# EAGLE design RocketInstrumentation (EAGLE 5.11)
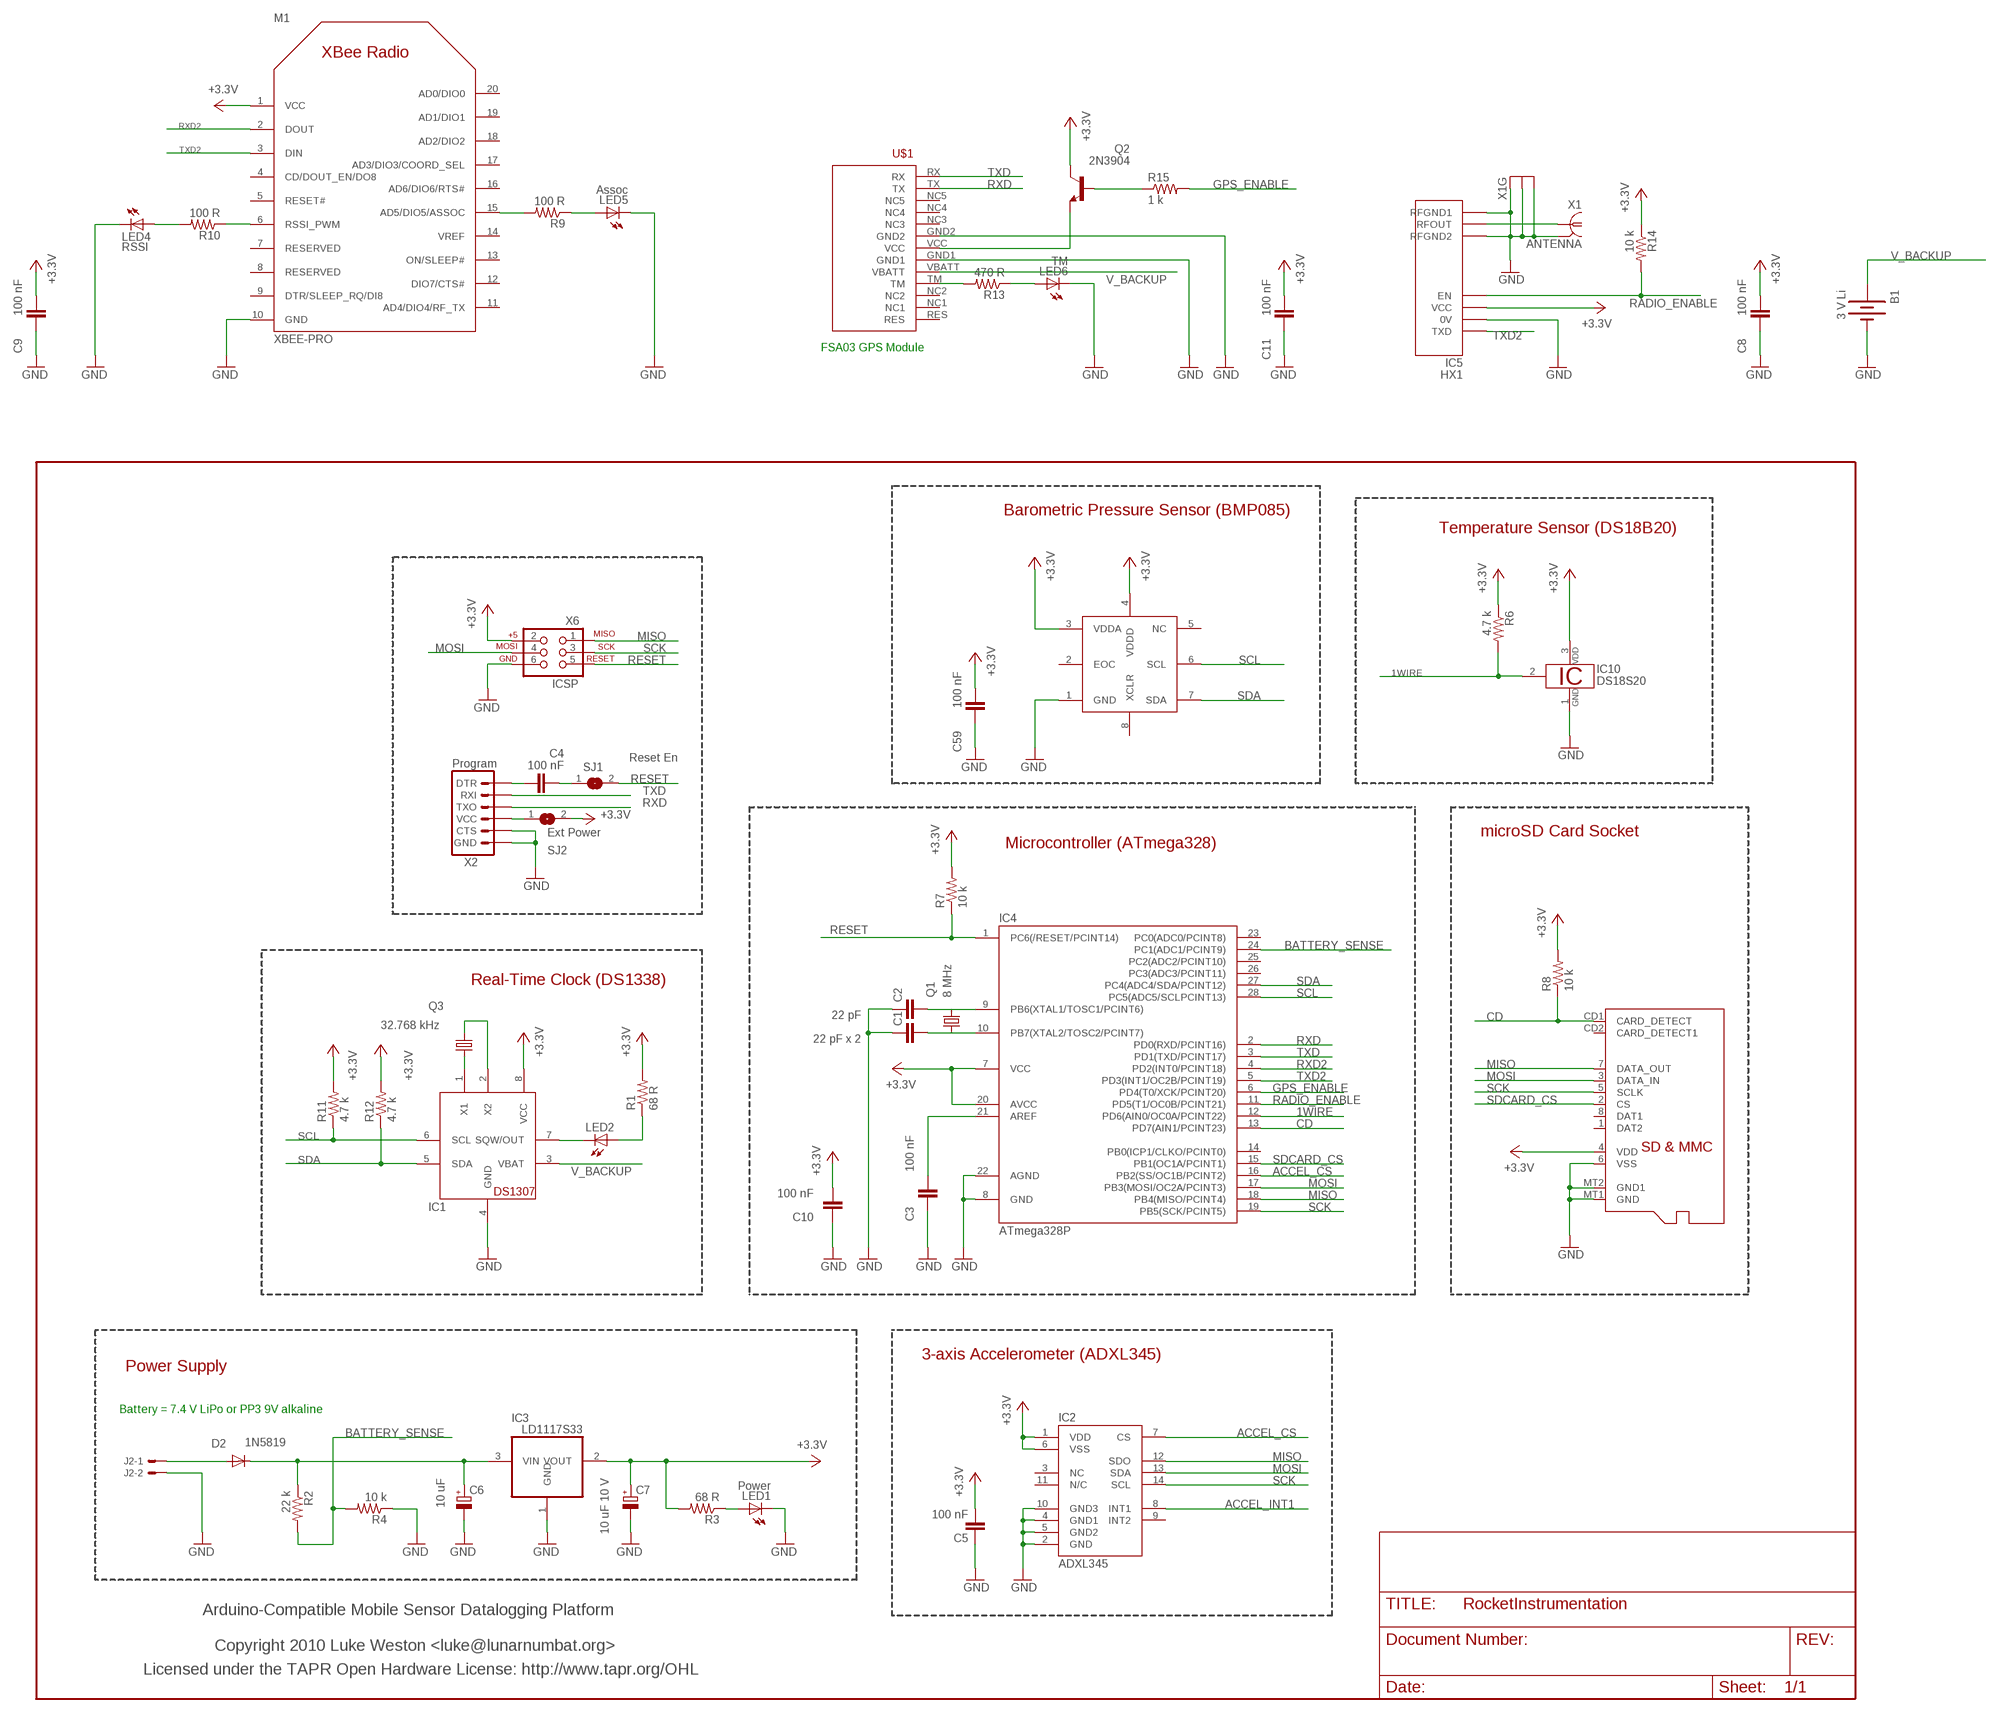
[diagram p0: schematic, sheet 1]

## Parts
B1  3 V Li  BATTERY12PTH  [BATTCON_12MM_PTH]
C1  22 pF x 2  C-EU025-024X044  [C025-024X044]
C2  22 pF  C-EU025-024X044  [C025-024X044]
C3  100 nF  C-EU025-025X050  [C025-025X050]
C4  100 nF  C-EU025-025X050  [C025-025X050]
C5  100 nF  C-EU025-025X050  [C025-025X050]
C6  10 uF  CPOL-EUE2.5-7  [E2,5-7]
C7  10 uF 10 V  CPOL-EUE2.5-7  [E2,5-7]
C8  100 nF  C-EU025-025X050  [C025-025X050]
C9  100 nF  C-EU025-025X050  [C025-025X050]
C10  100 nF  C-EU025-025X050  [C025-025X050]
C11  100 nF  C-EU025-025X050  [C025-025X050]
C59  100 nF  C-EU025-025X050  [C025-025X050]
D2  1N5819  DIODE-DO35-10  [DO35-10]
IC1  DS1338  DS1307  [DIL08]
IC2  ADXL345  [LGA14]
IC3  LD1117S33  REG1117  [SOT223]
IC4  ATmega328P  ATMEGA48/88/168-PU  [DIL28-3]
IC5  HX1  [HX1]
IC6  BMP085  [BMP085]
IC10  DS18S20  [TO92-]
J2  22-23-2021  [22-23-2021]
LED1  Power  LED3MM  [LED3MM]
LED2  LED3MM  [LED3MM]
LED4  RSSI  LED3MM  [LED3MM]
LED5  Assoc  LED3MM  [LED3MM]
LED6  TM  LED3MM  [LED3MM]
M1  XBEE-PRO  [XBEE-PRO]
Q1  8 MHz  CRYSTALHC49UV  [HC49U-V]
Q2  2N3904  [TO92]
Q3  32.768 kHz  CRYSTALTC38H  [TC38H]
R1  68 R  R-US_FLIPFLOP  [0805-THM]
R2  22 k  R-US_FLIPFLOP  [0805-THM]
R3  68 R  R-US_FLIPFLOP  [0805-THM]
R4  10 k  R-US_FLIPFLOP  [0805-THM]
R6  4.7 k  R-US_FLIPFLOP  [0805-THM]
R7  10 k  R-US_FLIPFLOP  [0805-THM]
R8  10 k  R-US_FLIPFLOP  [0805-THM]
R9  100 R  R-US_FLIPFLOP  [0805-THM]
R10  100 R  R-US_FLIPFLOP  [0805-THM]
R11  4.7 k  R-US_FLIPFLOP  [0805-THM]
R12  4.7 k  R-US_FLIPFLOP  [0805-THM]
R13  470 R  R-US_FLIPFLOP  [0805-THM]
R14  10 k  R-US_FLIPFLOP  [0805-THM]
R15  1 k  R-US_0207/2V  [0207/2V]
SJ1  Reset En  SJ  [SJ]
SJ2  Ext Power  SJ  [SJ]
U$1  FSA03  [FSA03]
U$2  MICROSD  [MICROSD]
X1  ANTENNA  LTI-SASF54GT  [LTI-SASF54GT]
X2  Program  ARDUINO_SERIAL_PROGRAMLONGPADS  [1X06_LONGPADS]
X6  ICSP  AVR_SPI_PRG_6PTH  [2X3]

## Nets
1WIRE: IC4.12(PD6(AIN0/OC0A/PCINT22)) IC10.2 R6.2
+3V3: C5.2 C7.+ C8.2 C9.2 C10.2 C11.2 C59.2 IC1.8(VCC) IC2.1(VDD) IC2.6(VSS) IC3.2(VOUT) IC4.7(VCC) IC4.20(AVCC) IC5.VCC IC6.3(VDDA) IC6.4(VDDD) IC10.3 M1.1(VCC) Q2.1(C) R1.2 R3.2 R6.1 R7.2 R8.2 R11.2 R12.2 R14.1 SJ2.2 U$2.4(VDD) X6.2 ; supply symbol labelled +3.3V
ACCEL_CS: IC2.7(CS) IC4.16(PB2(SS/OC1B/PCINT2))
ACCEL_INT1: IC2.8(INT1)
BATTERY_SENSE: IC4.24(PC1(ADC1/PCINT9)) R2.2 R4.2
CD: IC4.13(PD7(AIN1/PCINT23)) R8.1 U$2.CD1(CARD_DETECT)
GND: B1.GND(-) C1.1 C2.1 C3.1 C5.1 C6.- C7.- C8.1 C9.1 C10.1 C11.1 C59.1 IC1.4(GND) IC2.2(GND) IC2.4(GND1) IC2.5(GND2) IC2.10(GND3) IC3.1(GND) IC4.8(GND) IC4.22(AGND) IC5.0V IC5.RFGND1 IC5.RFGND2 IC6.1(GND) IC10.1 J2.2 LED1.K(C) LED4.K(C) LED5.K(C) M1.10(GND) R4.1 U$2.6(VSS) U$2.MT1(GND) U$2.MT2(GND1) X1.2(GND) X1.3(GND) X1.4(GND) X1.5(GND) X2.5(CTS) X2.6(GND) X6.6
GPS_ENABLE: IC4.6(PD4(T0/XCK/PCINT20)) R15.2
MISO: IC2.12(SDO) IC4.18(PB4(MISO/PCINT4)) U$2.7(DATA_OUT) X6.1
MOSI: IC2.13(SDA) IC4.17(PB3(MOSI/OC2A/PCINT3)) U$2.3(DATA_IN) X6.4
N$1: C2.2 IC4.9(PB6(XTAL1/TOSC1/PCINT6)) Q1.2
N$2: C1.2 IC4.10(PB7(XTAL2/TOSC2/PCINT7)) Q1.1
N$3: C3.2 IC4.21(AREF)
N$4: C4.2 X2.1(DTR)
N$5: Q2.3(E) U$1.VCC
N$6: C6.+ D2.C IC3.3(VIN) R2.1
N$7: SJ2.1 X2.4(VCC)
N$8: LED1.A R3.1
N$9: D2.A J2.1
N$10: IC1.2(X2) Q3.1
N$11: IC1.1(X1) Q3.2
N$12: IC1.7(SQW/OUT) LED2.K(C)
N$13: LED2.A R1.1
N$14: R13.2 U$1.TM
N$15: IC5.RFOUT X1.1
N$16: M1.15(AD5/DIO5/ASSOC) R9.2
N$17: Q2.2(B) R15.1
N$19: M1.6(RSSI_PWM) R10.1
N$20: LED6.A R13.1
N$21: LED4.A R10.2
N$22: LED5.A R9.1
N$36: LED6.K(C) U$1.GND1 U$1.GND2 ; supply symbol labelled GND
N$56: C4.1 SJ1.1
RADIO_ENABLE: IC4.11(PD5(T1/OC0B/PCINT21)) IC5.EN R14.2
RESET: IC4.1(PC6(/RESET/PCINT14)) R7.1 SJ1.2 X6.5
RXD: IC4.2(PD0(RXD/PCINT16)) U$1.TX X2.3(TXO)
RXD2: IC4.4(PD2(INT0/PCINT18)) M1.2(DOUT)
SCK: IC2.14(SCL) IC4.19(PB5(SCK/PCINT5)) U$2.5(SCLK) X6.3
SCL: IC1.6(SCL) IC4.28(PC5(ADC5/SCLPCINT13)) IC6.6(SCL) R11.1
SDA: IC1.5(SDA) IC4.27(PC4(ADC4/SDA/PCINT12)) IC6.7(SDA) R12.1
SDCARD_CS: IC4.15(PB1(OC1A/PCINT1)) U$2.2(CS)
TXD: IC4.3(PD1(TXD/PCINT17)) U$1.RX X2.2(RXI)
TXD2: IC4.5(PD3(INT1/OC2B/PCINT19)) IC5.TXD M1.3(DIN)
V_BACKUP: B1.VCC@1(+) IC1.3(VBAT) U$1.VBATT
Unconnected: IC2.3(NC) IC2.9(INT2) IC2.11(N/C) IC4.14(PB0(ICP1/CLKO/PCINT0)) IC4.23(PC0(ADC0/PCINT8)) IC4.25(PC2(ADC2/PCINT10)) IC4.26(PC3(ADC3/PCINT11)) IC6.2(EOC) IC6.5(NC) IC6.8(XCLR) M1.4(CD/DOUT_EN/DO8) M1.5(RESET#) M1.7(RESERVED) M1.8(RESERVED) M1.9(DTR/SLEEP_RQ/DI8) M1.11(AD4/DIO4/RF_TX) M1.12(DIO7/CTS#) M1.13(ON/SLEEP#) M1.14(VREF) M1.16(AD6/DIO6/RTS#) M1.17(AD3/DIO3/COORD_SEL) M1.18(AD2/DIO2) M1.19(AD1/DIO1) M1.20(AD0/DIO0) U$1.NC1 U$1.NC2 U$1.NC3 U$1.NC4 U$1.NC5 U$1.RES U$2.1(DAT2) U$2.8(DAT1) U$2.CD2(CARD_DETECT1)

## Notes on the sheet
- FSA03 GPS Module
- Barometric Pressure Sensor (BMP085)
- Temperature Sensor (DS18B20)
- microSD Card Socket
- Microcontroller (ATmega328)
- Real-Time Clock (DS1338)
- 3-axis Accelerometer (ADXL345)
- Power Supply
- Battery = 7.4 V LiPo or PP3 9V alkaline
- Arduino-Compatible Mobile Sensor Datalogging Platform
- Copyright 2010 Luke Weston <luke@lunarnumbat.org>
- Licensed under the TAPR Open Hardware License: http://www.tapr.org/OHL

## Library data of the parts
B1 = SparkFun:BATTERY: Battery Holders Various common sizes : AA, AAA, 20mm coin cell and 12mm coin cell.
C1-C5 C8-C11 C59 = rcl:C-EU: CAPACITOR, European symbol
C6 C7 = rcl:CPOL-EU: POLARIZED CAPACITOR, European symbol
D2 = diode:DIODE-: DIODE
IC1 = adafruit:DS1307: DS1307 Real time clock (RTC) with battery backup ability. Talk to it via i2c
IC2 = SparkFun:ADXL345
IC3 = burr-brown:REG1117: 800mA and 1A Low Dropout (LDO) Positive Regulator 1.8V, 2.5V, 2.85V, 3.3V, 5V, and Adj
IC4 = atmega8:ATMEGA48/88/168-PU
IC5 = trackuino:HX1
IC6 = SparkFun:BMP085
IC10 = 1wire:DS18S20: High Precision Digital Thermometer This chip provides a onewire thermosensor with approx. 0.5°C accuracy.A programmable over/undertemperure alarm is available. Notes: Vdd must be applied for accurate measurements at low temperatures, as the parasite power circuit otherwise heats the sensor. If parasite power is used, Vdd has to be connected to GND. The DS1822 is a low-cost thermometer chip, the DS18B20 is similar to the DS18S20, but with 9..12 Bit programmable precision. Author: Jan Kandziora <jjj@gmx.de>
J2 = con-molex:22-23-2021: .100" (2.54mm) Center Header - 2 Pin
LED1 LED2 LED4-LED6 = led:LED: LED OSRAM: - CHIPLED LG R971, LG N971, LY N971, LG Q971, LY Q971, LO R971, LY R971 LH N974, LH R974 LS Q976, LO Q976, LY Q976 LO Q996 - Hyper CHIPLED LW Q18S LB Q993, LB Q99A, LB R99A - SideLED LS A670, LO A670, LY A670, LG A670, LP A670 LB A673, LV A673, LT A673, LW A673 LH A674 LY A675 LS A676, LA A676, LO A676, LY A676, LW A676 LS A679, LY A679, LG A679 - Hyper Micro SIDELED® LS Y876, LA Y876, LO Y876, LY Y876 LT Y87S - SmartLED LW L88C, LW L88S LB L89C, LB L89S, LG L890 LS L89K, LO L89K, LY L89K LS L896, LA L896, LO L896, LY L896 - TOPLED LS T670, LO T670, LY T670, LG T670, LP T670 LSG T670, LSP T670, LSY T670, LOP T670, LYG T670 LG T671, LOG T671, LSG T671 LB T673, LV T673, LT T673, LW T673 LH T674 LS T676, LA T676, LO T676, LY T676, LB T676, LH T676, LSB T676, LW T676 LB T67C, LV T67C, LT T67C, LS T67K, LO T67K, LY T67K, LW E67C LS E67B, LA E67B, LO E67B, LY E67B, LB E67C, LV E67C, LT E67C LW T67C LS T679, LY T679, LG T679 LS T770, LO T770, LY T770, LG T770, LP T770 LB T773, LV T773, LT T773, LW T773 LH T774 LS E675, LA E675, LY E675, LS T675 LS T776, LA T776, LO T776, LY T776, LB T776 LHGB T686 LT T68C, LB T68C - Hyper Mini TOPLED® LB M676 - Mini TOPLED Santana® LG M470 LS M47K, LO M47K, LY M47K Source: http://www.osram.convergy.de - LUMILED® LXK2-PW12-R00, LXK2-PW12-S00, LXK2-PW14-U00, LXK2-PW14-V00 LXK2-PM12-R00, LXK2-PM12-S00, LXK2-PM14-U00 LXK2-PE12-Q00, LXK2-PE12-R00, LXK2-PE12-S00, LXK2-PE14-T00, LXK2-PE14-U00 LXK2-PB12-K00, LXK2-PB12-L00, LXK2-PB12-M00, LXK2-PB14-N00, LXK2-PB14-P00, LXK2-PB14-Q00 LXK2-PR12-L00, LXK2-PR12-M00, LXK2-PR14-Q00, LXK2-PR14-R00 LXK2-PD12-Q00, LXK2-PD12-R00, LXK2-PD12-S00 LXK2-PH12-R00, LXK2-PH12-S00 LXK2-PL12-P00, LXK2-PL12-Q00, LXK2-PL12-R00 Source: www.luxeon.com
M1 = xbee_r1:XBEE
Q1 = SparkFun:CRYSTAL: Crystals Various standard crystals. Proven footprints. Spark Fun Electronics SKU : COM-00534
Q2 = transistor:2N3904: NPN TRANSISTOR
Q3 = crystal:CRYSTAL: CRYSTAL
R1-R4 R6-R15 = adafruit:R-US_: RESISTOR, American symbol
SJ1 SJ2 = jumper:SJ: SMD solder JUMPER
U$1 = FSA03:FSA03: Falcom FSA03 surface mount GPS with ublox chipset, part created by Landon Cox, ESawdust.com
U$2 = adafruit:MICROSD: Micro-SD / Transflash card holder with SPI pinout For the 3M # 2908-05WB-MG and/or 4UCON #19656 push-push type
X1 = con-coax:LTI-SASF54GT: SMA vertical PCB thrue hole jack Source: Lighthorse Technologies, inc. SASF54GT.pdf
X2 = SparkFun:ARDUINO_SERIAL_PROGRAM
X6 = SparkFun:AVR_SPI_PRG_6: AVR ISP 6 Pin This is the reduced ISP connector for AVR programming. Common on Arduino. This footprint will take up less PCB space and can be used with a 10-pin to 6-pin adapter such as SKU: BOB-08508

## Net classes
1 vcc: width 0.254 mm

## Board
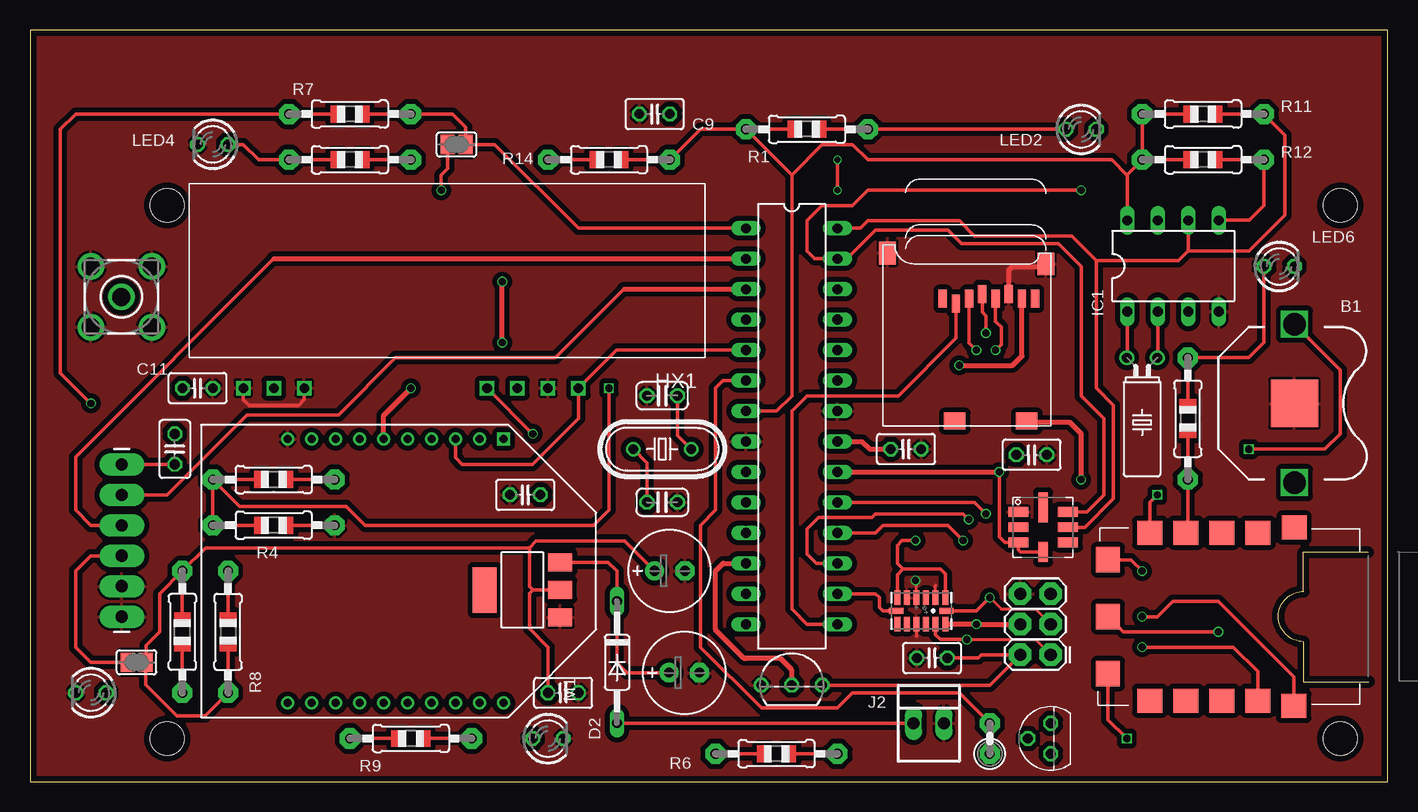
[diagram p1: board, top side]
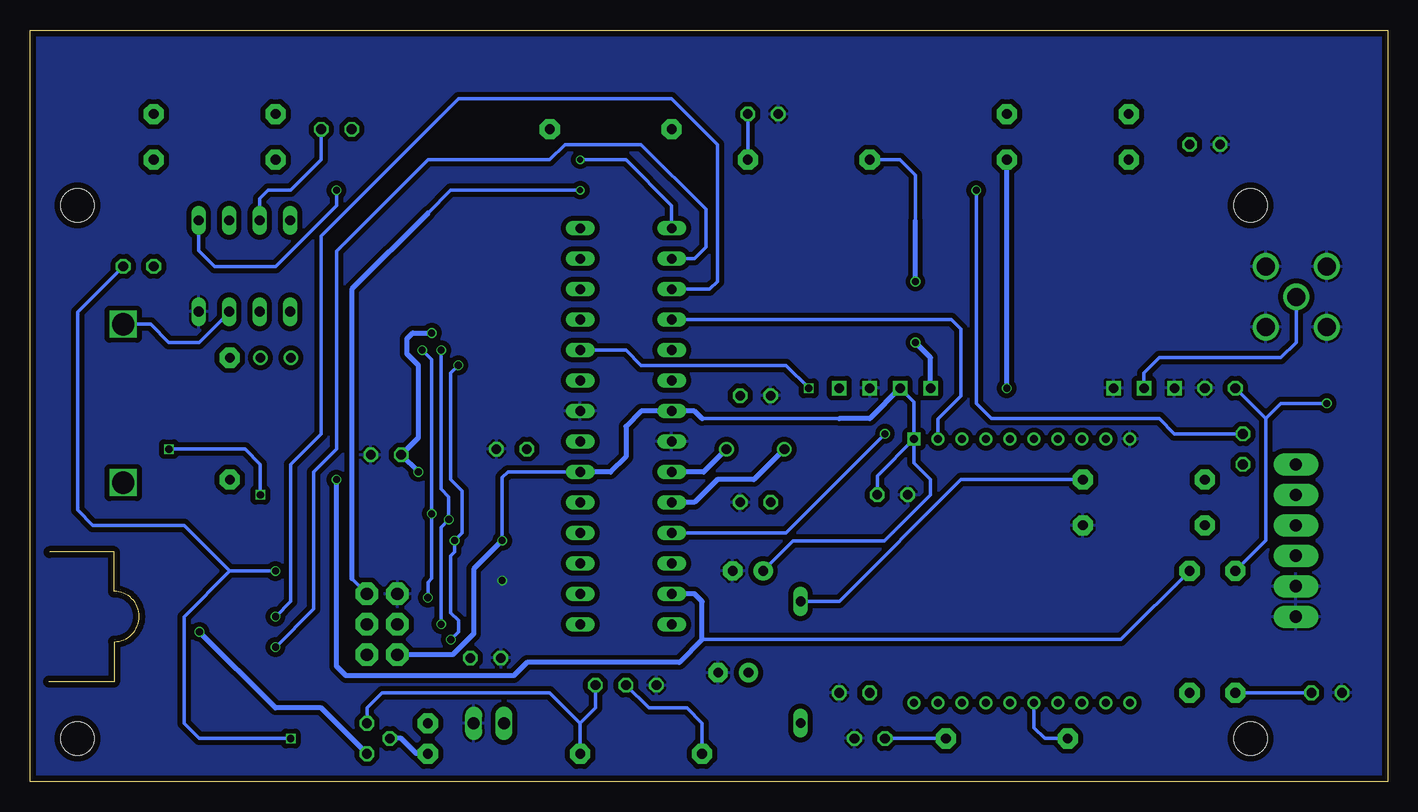
[diagram p2: board, bottom side, seen from below]

Size 113.18 x 62.7 mm. Coordinates in mm from the lower left corner, seen from the top.
Outline: 0,0 113.18,0 113.18,62.7 0,62.7 0,0
Copper layers (1*16): Top 0.035mm / dielectric 1.5mm / Bottom 0.035mm
Design rules "PCBCart-.3mmHoles-.1mmAnnulars": minimum track width 8mil, minimum drill 0.3mm, track to track 8mil, track to pad 8mil, pad to pad 8mil, via to via 8mil, smd to smd 8mil, copper to edge 20mil, drill to drill 8mil, minimum pad ring 8mil, minimum via ring 4mil, stop-mask expansion 3mil, vias tented up to drill 0mil, thermal gap 8mil
Holes 2.8 mm at 11.43,48.07 11.43,3.62 109.22,3.62 109.22,48.07

### Footprints (pad centres in the part's own frame; a part is rotated, then mirrored left to right if it is on the bottom)
BATTCON_12MM_PTH = smd 3.962 x 3.962: GND 0,0 | drill 1.854 square: VCC@1 -6.604,0; VCC@2 6.604,0
C025-024X044 = drill 0.813 octagon: 1 -1.27,0; 2 1.27,0
C025-025X050 = drill 0.813 octagon: 1 -1.27,0; 2 1.27,0
E2,5-7 = drill 0.813 pad 1.6 round: + -1.27,0 | drill 0.813 pad 1.6 octagon: - 1.27,0
DO35-10 = drill 0.813 long: A 5.08,0; C -5.08,0
DIL08 = drill 0.813 long: 1 -3.81,-3.81; 2 -1.27,-3.81; 3 1.27,-3.81; 4 3.81,-3.81; 5 3.81,3.81; 6 1.27,3.81; 7 -1.27,3.81; 8 -3.81,3.81
LGA14 = smd 0.5 x 1.2: 1 2,1.1; 2 1.2,1.1; 3 0.4,1.1; 4 -0.4,1.1; 5 -1.2,1.1; 6 -2,1.1; 8 -2,-1.1; 9 -1.2,-1.1; 10 -0.4,-1.1; 11 0.4,-1.1; 12 1.2,-1.1; 13 2,-1.1 | smd 1.2 x 0.5: 7 -2.1,0; 14 2.1,0
SOT223 = smd 1.499 x 2.007: 1 -2.261,-3.15; 2 0.025,-3.15; 3 2.311,-3.15 | smd 3.81 x 2.007: 4 0,3.15
DIL28-3 = drill 0.813 long: 1 -16.51,-3.81; 2 -13.97,-3.81; 3 -11.43,-3.81; 4 -8.89,-3.81; 5 -6.35,-3.81; 6 -3.81,-3.81; 7 -1.27,-3.81; 8 1.27,-3.81; 9 3.81,-3.81; 10 6.35,-3.81; 11 8.89,-3.81; 12 11.43,-3.81; 13 13.97,-3.81; 14 16.51,-3.81; 15 16.51,3.81; 16 13.97,3.81; 17 11.43,3.81; 18 8.89,3.81; 19 6.35,3.81; 20 3.81,3.81; 21 1.27,3.81; 22 -1.27,3.81; 23 -3.81,3.81; 24 -6.35,3.81; 25 -8.89,3.81; 26 -11.43,3.81; 27 -13.97,3.81; 28 -16.51,3.81
HX1 = drill 0.8 square: 0V 25.4,-8.89; EN 20.32,-8.89; RFGND1 0,-8.89; RFGND2 5.08,-8.89; RFOUT 2.54,-8.89; TXD 27.94,-8.89; VCC 22.86,-8.89
BMP085 = smd 1.67 x 0.8: 1 -2.065,1.27; 2 -2.065,0; 3 -2.065,-1.27; 5 2.065,-1.27; 6 2.065,0; 7 2.065,1.27 | smd 0.8 x 1.67: 4 0,-2.065 | smd 0.8 x 2.5: 8 0,1.65
TO92- = drill 0.813 octagon: 1 -2.54,0; 2 0,0; 3 2.54,0
22-23-2021 = drill 1 long: 1 -1.27,0; 2 1.27,0
LED3MM = drill 0.813 octagon: A -1.27,0; K 1.27,0
XBEE-PRO = drill 0.66 square: 1 -11,9 | drill 0.66 round: 2 -11,7; 3 -11,5; 4 -11,3; 5 -11,1; 6 -11,-1; 7 -11,-3; 8 -11,-5; 9 -11,-7; 10 -11,-9; 11 11,-9; 12 11,-7; 13 11,-5; 14 11,-3; 15 11,-1; 16 11,1; 17 11,3; 18 11,5; 19 11,7; 20 11,9
HC49U-V = drill 0.813 round: 1 -2.413,0; 2 2.413,0
TO92 = drill 0.813 octagon: 1 1.27,0; 2 0,1.905; 3 -1.27,0
TC38H = drill 0.813 round: 1 -1.27,0; 2 1.27,0
0805-THM = drill 0.813 pad 1.676 octagon: 1 -5.08,0; 2 5.08,0
0207/2V = drill 0.813 pad 1.676 octagon: 1 -1.27,0; 2 1.27,0
SJ = smd 1.168 x 1.6: 1 -0.762,0; 2 0.762,0
FSA03 = smd 2.1 x 2: GND1 -4.75,-6.5; GND2 4.75,-6.5; VCC 0,-6.5 | smd 2 x 2.1: NC1 -7,6; NC2 -7,3; NC3 7,-3; NC4 7,0; NC5 7,3; RES -7.43,9.025; RX 7.454,9; TM -7,0; TX 7,6; VBATT -7,-3
MICROSD = smd 0.7 x 1.5: 1 9,-10.64; 2 7.9,-10.24; 3 6.8,-10.64; 4 5.7,-11.04; 5 4.6,-10.64; 6 3.5,-11.04; 7 2.4,-10.64; 8 1.3,-10.64 | smd 1.8 x 1.4: CD1 2,-0.44; CD2 8,-0.44 | smd 1.4 x 1.9: MT1 0.4,-13.54; MT2 13.6,-14.44
LTI-SASF54GT = drill 1.5 pad 2.2 round: 1 0,0; 2 -2.54,2.54; 3 2.54,2.54; 4 2.54,-2.54; 5 -2.54,-2.54
1X06_LONGPADS = drill 1.016 pad 1.88 long: 1 0,0; 2 2.54,0; 3 5.08,0; 4 7.62,0; 5 10.16,0; 6 12.7,0
2X3 = drill 1.016 pad 1.88 octagon: 1 0,0; 2 0,2.54; 3 2.54,0; 4 2.54,2.54; 5 5.08,0; 6 5.08,2.54

### Placement (x,y rotation side)
B1  105.41,31.56 270 top
C1  52.71,23.32 180 top
C2  52.71,32.21 0 top
C3  73.03,27.75 180 top
C4  12.07,27.75 270 top
C5  75.2,10.34 0 top
C6  54.55,9.11 0 top
C7  53.33,17.6 0 top
C8  44.45,7.43 180 top
C9  52.07,55.69 0 top
C10  41.28,23.94 0 top
C11  13.97,32.83 180 top
C59  83.5,27.27 180 top
D2  48.94,9.98 270 top
IC1  95.3,43.02 0 top
IC2  74.3,14.26 0 top
IC3  41.05,16 90 top
IC4  63.5,29.65 270 top
IC5  17.78,41.72 0 top
IC6  84.46,21.24 0 top
IC10  63.5,8.07 0 top
J2  74.93,4.89 0 top
LED1  5.08,7.43 180 top
LED2  87.63,54.42 0 top
LED4  15.24,53.15 180 top
LED5  43.18,3.62 0 top
LED6  104.14,42.99 0 top
M1  30.48,17.59 270 top
Q1  52.71,27.75 0 top
Q2  85.09,3.62 90 top
Q3  92.71,35.37 180 top
R1  64.77,54.42 180 top
R2  20.32,25.21 180 top
R3  12.7,12.51 90 top
R4  20.32,21.4 180 top
R6  62.23,2.35 180 top
R7  26.67,55.69 180 top
R8  16.51,12.51 270 top
R9  31.75,3.62 180 top
R10  26.67,51.88 180 top
R11  97.79,55.69 180 top
R12  97.79,51.88 180 top
R13  96.52,30.29 270 top
R14  48.26,51.88 180 top
R15  80.01,3.62 90 top
SJ1  35.56,53.15 0 top
SJ2  8.89,9.97 0 top
U$1  96.36,13.78 270 top
U$2  85.09,29.65 180 top
X1  7.62,40.45 0 top
X2  7.65,26.48 270 top
X6  85.09,10.61 90 top

### Tracks (layer width: path | path; a pad name or v marks a point on that pad's centre or on a via)
1WIRE
  Top 0.406: 57.15,12.67 57.15,17.59 57.79,18.22 IC4.12 | IC10.2 63.5,9.34 62.55,10.29 59.69,10.29 | 57.15,12.67 | 57.15,12.67 59.53,10.29 59.69,10.29 | 59.69,10.29
  Bottom 0.305: R6.2 57.15,4.89 58.42,6.16 61.59,6.16 IC10.2
+3V3  (via drill 0.6)
  Top 0.254: 79.38,40.68 U$2.4
  Top 0.305: IC2.1 76.3,17.34 75.88,17.75 72.77,17.75 | 72.77,17.75 72.3,18.22 72.3,19.72 72.71,20.13 v73.82,20.13 | IC2.6 72.3,17.27 72.77,17.75 | 79.38,40.68 79.38,39.18 79.69,38.86 v79.69,37.43 | C5.2 79.05,10.34 79.32,10.61 X6.2 80.01,8.07 IC10.3 | 80.64,25.84 80.8,25.69 80.8,20.45 81.28,19.97 IC6.3 82.39,19.34 82.55,19.18 IC6.4 | 41.63,19.52 42.21,20.1 49.56,20.1 C7.+ | 41.63,19.52 41.63,16.32 41.92,16.02 | 41.92,16.02 IC3.2 | 41.92,16.02 41.63,15.73 41.63,12.79 43.18,11.24 C8.2 | R11.2 R12.2 91.49,50.66 IC1.8 91.49,50.56 90.17,51.88 69.85,51.88 68.58,53.15 66.04,53.15 63.5,50.61 | 63.5,50.61 63.5,32.2 62.23,30.92 IC4.7 | 63.5,50.61 R1.2 55.88,54.42 R14.1 | 41.63,19.52 14.63,19.52 R3.2 10.79,15.68 10.79,12.51 9.68,11.4 9.68,10 SJ2.2 9.65,8.1 12.22,5.53 14.61,5.53 R8.2 | R7.2 3.81,55.69 2.54,54.42 2.54,34.1 v5.08,31.56
  Top 0.406: IC4.20 80.64,25.84 v80.8,25.84
  Bottom 0.305: v73.82,20.13 73.82,25.37 73.34,25.84 IC4.20 | M1.1 39.48,31.67 IC5.VCC | C7.+ 49.56,20.1 41.94,20.1 38.1,23.94 38.1,25.21 39.48,26.59 M1.1 | IC10.3 66.04,6.16 67.31,4.89 | 67.31,4.89 R6.1 | C10.2 42.55,25.52 M1.1 | 45.72,30.29 57.15,30.29 | 67.31,4.89 69.85,7.43 83.82,7.43 85.09,6.16 Q2.1 | v5.08,31.56 8.89,31.56 10.16,30.29 | 10.16,30.29 10.16,20.13 R3.2 | 10.16,30.29 C11.2 | R14.1 C9.2
  Bottom 0.406: v79.69,37.43 81.28,37.43 81.76,36.96 81.76,35.69 80.8,34.73 80.8,28.7 C59.2 v80.8,25.84 | X6.2 77.95,10.61 76.2,12.35 76.2,17.75 v73.82,20.13 | IC4.20 64.77,25.84 63.5,27.11 63.5,29.65 62.23,30.92 IC4.7 57.79,30.92 57.15,30.29 | 45.72,30.29 43.18,30.29 IC5.VCC
ACCEL_CS
  Top 0.305: IC2.7 71.12,14.26 70.8,14.57 70.8,15.37 70.48,15.68 IC4.16
BATTERY_SENSE  (via drill 0.6)
  Top 0.305: R4.2 R2.2 17.46,22.99 26.35,22.99 27.94,21.4 46.99,21.4 48.26,22.67 v48.26,32.83
  Bottom 0.305: IC4.24 63.5,36.01 62.23,34.73 50.16,34.73 v48.26,32.83
CD  (via drill 0.6)
  Top 0.254: 83.21,29.97 U$2.CD1
  Top 0.406: 83.21,29.97 86.68,29.97 87.63,29.02 v87.63,25.21
  Bottom 0.305: 57.15,11.88 22.22,11.88 R8.1
  Bottom 0.406: IC4.13 57.79,15.68 57.15,15.05 57.15,11.88 59.05,9.97 71.75,9.97 72.87,8.86 86.84,8.86 87.63,9.65 v87.63,25.21
GND  (via drill 0.6)
  Top 0.254: IC2.10 73.89,12.11 | IC2.4 73.89,16.72 73.66,16.95 | IC2.2 75.5,16.39 | 84.48,42.99 U$2.MT1
  Top 0.305: IC5.RFGND2 22.86,31.88 22.38,31.4 18.26,31.4 17.78,31.88 IC5.RFGND1
  Top 0.406: 84.48,42.99 81.92,42.99 81.59,42.66 U$2.6
  other vias: 73.82,16.8
  pour Bottom (isolate 0.406): -2.54,64.58 114.3,64.58 115.57,-1.46 -2.54,-1.46
  pour Top (isolate 0.406): -1.27,64.58 115.57,64.58 115.57,-1.46 -1.27,-1.46
GPS_ENABLE
  Top 0.305: R15.2 77.47,7.43 68.58,7.43 67.31,6.16 60.96,6.16 55.88,11.24 55.88,21.4 57.15,22.67 57.15,32.83 57.79,33.46 IC4.6
MISO  (via drill 0.6)
  Top 0.254: X6.1 83.82,11.88 v78.11,11.88
  Top 0.305: IC2.12 75.5,12.26 75.88,11.88 v78.11,11.88 | IC4.18 70.48,20.77 71.12,21.4 76.52,21.4 v77.79,20.13
  Top 0.406: U$2.7 82.69,35.51 81.92,34.73 v77.47,34.73
  Bottom 0.305: v77.47,34.73 78.11,34.1 78.11,25.21 77.15,24.26 77.15,20.77 v77.79,20.13 77.79,19.18 78.11,18.86 78.11,14.1 77.47,13.46 77.47,12.51 v78.11,11.88
MOSI  (via drill 0.6)
  Top 0.254: 76.31,13.14 IC2.13
  Top 0.305: IC4.17 65.56,18.22 64.77,19.02 64.77,21.08 65.72,22.04 70.17,22.04 70.48,22.35 77.79,22.35 v78.26,21.88 | U$2.3 78.29,36.61 v78.9,36.01
  Top 0.406: 76.31,13.14 v78.9,13.14 X6.4
  Bottom 0.305: v78.9,13.14 78.9,21.24 v78.26,21.88 78.26,23.78 78.9,24.42 v78.9,36.01
N$1
  Top 0.305: C2.2 53.98,28.89 Q1.2
  Top 0.406: Q1.2 55.25,27.88
  Bottom 0.406: IC4.9 57.02,25.84 Q1.2
N$2
  Top 0.305: C1.2 51.44,26.61 Q1.1
  Bottom 0.406: IC4.10 57.79,23.3 55.88,25.21 52.83,25.21 Q1.1 50.16,27.62
N$3
  Top 0.406: IC4.21 69.37,28.38 70.01,27.75 C3.2
N$4
  Top 0.305: X2.1 C4.2 | C4.2
N$5  (via drill 0.6)
  Top 0.305: v99.06,12.51 91.13,12.51 U$1.VCC
  Bottom 0.406: Q2.3 88.9,6.16 92.71,6.16 v99.06,12.51
N$6
  Top 0.305: IC3.3 48.2,18.31 48.94,17.58 D2.C 48.93,9.95 49.77,9.11 C6.+
  Bottom 0.305: D2.C 48.93,15.05 45.72,15.05 35.56,25.21 R2.1
N$7
  Top 0.305: SJ2.1 5.08,9.97 3.81,11.24 3.81,17.59 5.08,18.86 X2.4
N$8
  Bottom 0.305: LED1.A R3.1
N$9
  Top 0.305: J2.1 D2.A
N$10
  Top 0.305: IC1.2 94.03,35.42 Q3.1
N$11
  Top 0.305: IC1.1 91.49,35.42 Q3.2
N$12
  Bottom 0.305: LED2.K 88.9,51.88 91.44,49.34 93.34,49.34 94.03,48.66 IC1.7
N$13
  Top 0.305: R1.1 LED2.A
N$14
  Top 0.305: R13.2 96.52,20.94 U$1.TM
N$15
  Bottom 0.305: X1.1 7.62,36.64 8.89,35.37 19.05,35.37 20.32,34.1 IC5.RFOUT
N$16
  Bottom 0.305: M1.15 29.48,4.53 28.57,3.62 R9.2
N$17
  Bottom 0.406: R15.1 80.96,2.35 82.23,3.62 Q2.2
N$19  (via drill 0.6)
  Top 0.406: M1.6 29.48,30.56 v31.75,32.83
  Bottom 0.406: v31.75,32.83 R10.1
N$20
  Top 0.305: LED6.A 102.87,36.64 101.6,35.37 R13.1
N$21
  Top 0.305: LED4.A 17.78,53.15 19.05,51.88 R10.2
N$22
  Bottom 0.305: R9.1 LED5.A
N$36  (via drill 0.6)
  Top 0.305: U$1.GND1 91.77,18.53 v92.71,17.59 | U$1.GND2 89.86,5.2 v91.44,3.62
  Bottom 0.305: LED6.K 109.22,39.18 109.22,22.67 107.95,21.4 100.33,21.4 96.52,17.59 | 96.52,17.59 v92.71,17.59 | v91.44,3.62 99.06,3.62 100.33,4.89 100.33,13.78 96.52,17.59
N$56  (via drill 0.6)
  Top 0.305: v34.29,49.34 34.29,50.61 34.8,51.12 SJ1.1
  Bottom 0.305: C4.1 17.78,29.02 19.05,30.29 33.02,30.29 34.29,31.56 v34.29,49.34
RADIO_ENABLE  (via drill 0.6)
  Top 0.305: IC5.EN v41.91,29.02
  Top 0.406: v39.37,36.64 v39.37,41.72
  Bottom 0.305: IC4.11 50.16,20.77 v41.91,29.02 | 39.37,46.8 39.37,50.61 40.64,51.88 R14.2
  Bottom 0.406: IC5.EN 38.1,35.37 v39.37,36.64 | v39.37,41.72 39.37,46.8
RESET  (via drill 0.5 pad 0.41)
  Top 0.305: v67.31,51.88 v67.31,49.34 | IC4.1 45.72,46.16 38.73,53.15 SJ1.2 36.32,54.61 35.24,55.69 R7.1
  Bottom 0.305: 86.36,16.95 X6.5 | IC4.1 59.69,48.07 63.5,51.88 v67.31,51.88 | v67.31,49.34 78.11,49.34 80.01,47.44
  Bottom 0.406: 86.36,16.95 86.36,41.09 80.01,47.44
RXD  (via drill 0.6)
  Top 0.305: X2.3 5.08,21.4 3.81,22.67 3.81,27.11 20.32,43.62 | v92.71,11.24 100.33,11.24 102.36,9.21 U$1.TX
  Top 0.406: 20.32,43.62 IC4.2
  Bottom 0.305: IC4.2 57.79,43.62 56.83,44.58 56.83,47.75 62.23,53.15 68.58,53.15 69.85,51.88 80.01,51.88 87.63,44.26 87.63,27.75 89.53,25.84 89.53,14.41 v92.71,11.24
RXD2
  Bottom 0.305: M1.2 37.48,30.27 35.56,32.2 35.56,37.75 36.35,38.55 IC4.4
SCK  (via drill 0.6)
  Top 0.254: U$2.5 | X6.3 83.82,14.41 80.96,14.41 v80.01,15.37
  Top 0.305: U$2.5 80.49,38.39 80.96,37.91 80.96,36.48 v80.49,36.01 | IC2.14 78.9,14.26 v80.01,15.37 | IC4.19 78.74,23.3 v79.69,22.35
  Bottom 0.305: v80.49,36.01 79.69,35.21 v79.69,22.35 79.69,16.95 80.01,16.64 v80.01,15.37
SCL
  Top 0.305: IC4.28 69.22,46.16 69.85,46.8 77.47,46.8 78.74,45.53 86.84,45.53 88.9,43.47 | 88.9,43.47 88.9,32.83 90.33,31.4 90.33,23.62 87.95,21.24 IC6.6 | 88.9,43.47 95.73,43.47 96.52,44.26 | IC1.6 96.57,44.31 96.52,44.26 | R11.1 | R11.1 104.62,53.94 104.62,47.28 101.6,44.26 96.52,44.26
SDA  (via drill 0.6)
  Top 0.305: IC6.7 88.11,22.51 89.53,23.94 89.53,30.29 87.63,32.2 87.63,42.99 85.73,44.89 77.63,44.89 76.52,46.01 70.48,46.01 68.1,43.62 IC4.27 65.41,43.62 64.77,44.26 64.77,46.8 66.04,48.07 68.58,48.07 69.85,49.34 v87.63,49.34 | IC1.5 101.63,46.83 102.87,48.07 R12.1
  Bottom 0.305: IC1.5 99.11,44.31 97.79,42.99 92.71,42.99 87.63,48.07 v87.63,49.34
SDCARD_CS
  Top 0.305: U$2.2 77.19,36.99 72.39,32.2 64.77,32.2 63.5,30.92 63.5,14.41 64.77,13.14 IC4.15
TXD  (via drill 0.6)
  Top 0.305: X2.2 11.43,23.94 18.1,30.61 25.72,30.61 30.48,35.37 43.82,35.37 49.53,41.09 | v92.71,13.78 93.98,13.78 95.25,15.05 99.06,15.05 105.36,8.75 U$1.RX
  Top 0.406: 49.53,41.09 IC4.3
  Bottom 0.305: IC4.3 56.52,41.09 55.88,41.72 55.88,53.15 59.69,56.96 77.47,56.96 88.9,45.53 88.9,29.02 91.44,26.48 91.44,15.05 v92.71,13.78
TXD2
  Top 0.305: M1.3 35.48,27.04 36.04,26.48 41.91,26.48 45.72,30.29 IC5.TXD 48.9,36.01 IC4.5
V_BACKUP  (via drill 0.6)
  Top 0.305: B1.VCC@1 109.22,34.35 109.22,29.02 107.95,27.75 v101.6,27.75 | U$1.VBATT 93.36,23.32 v93.98,23.94
  Bottom 0.305: IC1.3 96.57,39.13 99.06,36.64 101.6,36.64 103.12,38.16 B1.VCC@1 | v93.98,23.94 93.98,26.48 95.25,27.75 v101.6,27.75

### Text on the board
tDocu: Licensed under the TAPR Open Hardware License (http://www.tapr.org/OHL) | Arduino-compatible Mobile Sensor Datalogging Platform | Luke Weston, 2010 | Clock | RadioMetrix NTX2 433 MHz RF module | DTR | 8 MHz | TXD | RXD | BMP085 | +3.3V | GND | GND | 10 uF | FSA03 GPS Module